# EAGLE design Shifter SMD v16 (EAGLE 6.4)
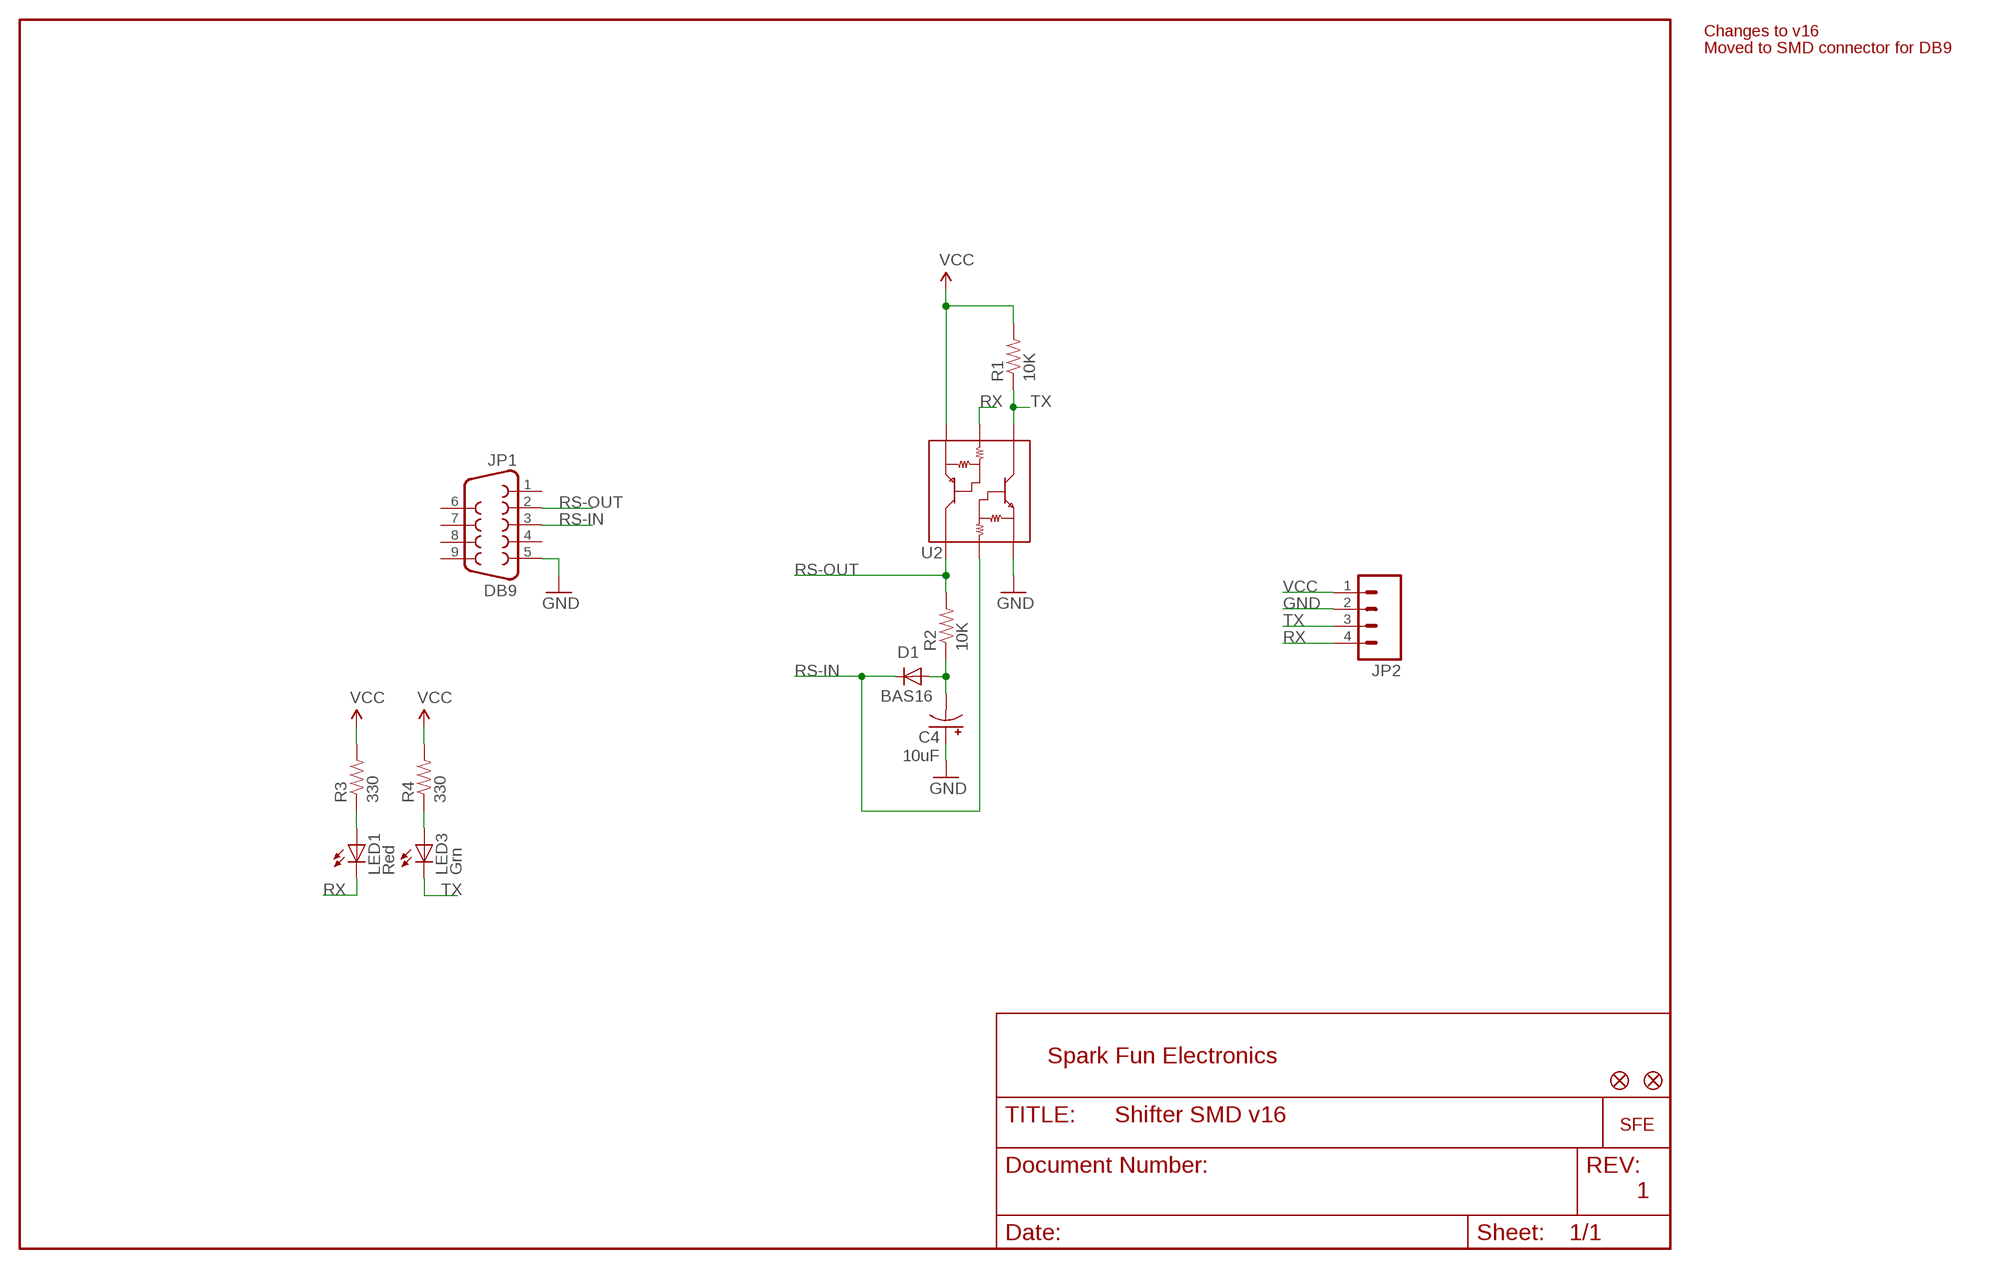
[diagram p0: schematic, sheet 1]

## Parts
C4  10uF  CAP_POL1206  [EIA3216]
D1  BAS16  DIODESOD  [SOD-323]
E$1  FIDUCIAL1X2  [FIDUCIAL-1X2]
E$2  FIDUCIAL1X2  [FIDUCIAL-1X2]
JP1  DB9  DB9L17SM209S114T  [DB9-L17SM209S114T]
JP2  M04PTH  [1X04]
LED1  Red  LED1206  [LED-1206]
LED3  Grn  LED1206  [LED-1206]
R1  10K  RESISTOR0603-RES  [0603-RES]
R2  10K  RESISTOR0603-RES  [0603-RES]
R3  330  RESISTOR0603-RES  [0603-RES]
R4  330  RESISTOR0603-RES  [0603-RES]
U2  XN04312  XN04312SOT  [SOT23-6]
U$1  LOGO-SFENEW  [SFE-NEW-WEBLOGO]

## Nets
GND: C4.A(+) JP1.5 JP2.2 U2.6(E1)
N$1: LED1.A R3.1
N$2: LED3.A R4.1
N$4: C4.C(-) D1.2(A) R2.1
RS-IN: D1.1(C) JP1.3 U2.5(B1)
RS-OUT: JP1.2 R2.2 U2.4(C2)
RX: JP2.4 LED1.C U2.2(B2)
TX: JP2.3 LED3.C R1.1 U2.1(C1)
VCC: JP2.1 R1.2 R3.2 R4.2 U2.3(E2)
Unconnected: JP1.1 JP1.4 JP1.6 JP1.7 JP1.8 JP1.9

## Notes on the sheet
- Changes to v16
- Moved to SMD connector for DB9
- Spark Fun Electronics
- 1

## Library data of the parts
C4 = SparkFun:CAP_POL: Capacitor Polarized These are standard SMD and PTH capacitors. Normally 10uF, 47uF, and 100uF in electrolytic and tantalum varieties. Always verify the external diameter of the through hole cap, it varies with capacity, voltage, and manufacturer. The EIA devices should be standard.
D1 = SparkFun:DIODE: Diode These are standard reverse protection diodes and small signal diodes. SMA package can handle up to about 1A. SOD-323 can handle about 200mA. What the SOD-323 package when ordering, there are some mfgs out there that are 5-pin packages.
E$1 E$2 = SparkFun:FIDUCIAL: Fiducial Alignment Points Various fiducial points for machine vision alignment.
JP1 = Testing:DB9: DB9 Connector Standard DB9 (D-Sub 9) serial connector. Can be used for CAN bus as well as RS485 and RS232. Footprint production proven. Spark Fun Electronics SKU : PRT-00429
JP2 = SparkFun:M04: Header 4 Standard 4-pin 0.1" header. Use with straight break away headers (SKU : PRT-00116), right angle break away headers (PRT-00553), swiss pins (PRT-00743), machine pins (PRT-00117), and female headers (PRT-00115). Molex polarized connector foot print use with SKU : PRT-08231 with associated crimp pins and housings.
LED1 LED3 = SparkFun:LED: LEDs Standard schematic elements and footprints for 5mm, 3mm, 1206, and 0603 sized LEDs. 5mm - Spark Fun Electronics SKU : COM-00529 (and others)
R1-R4 = SparkFun:RESISTOR: Resistor Basic schematic elements and footprints for 0603, 1206, and PTH resistors.
U2 = SparkFun:XN04312: NPN/PNP Transistor Array Handy dandy transistor array for level shifting and inverting signals. Spark Fun Electronics SKU : COM-00588
U$1 = SparkFun:LOGO-SFE: Spark Fun Electronics PCB Logo This is the standard Spark Fun Electronics PCB logo.

## Net classes
0 default: width 0.203 mm
1 power: width 0.203 mm

## Board
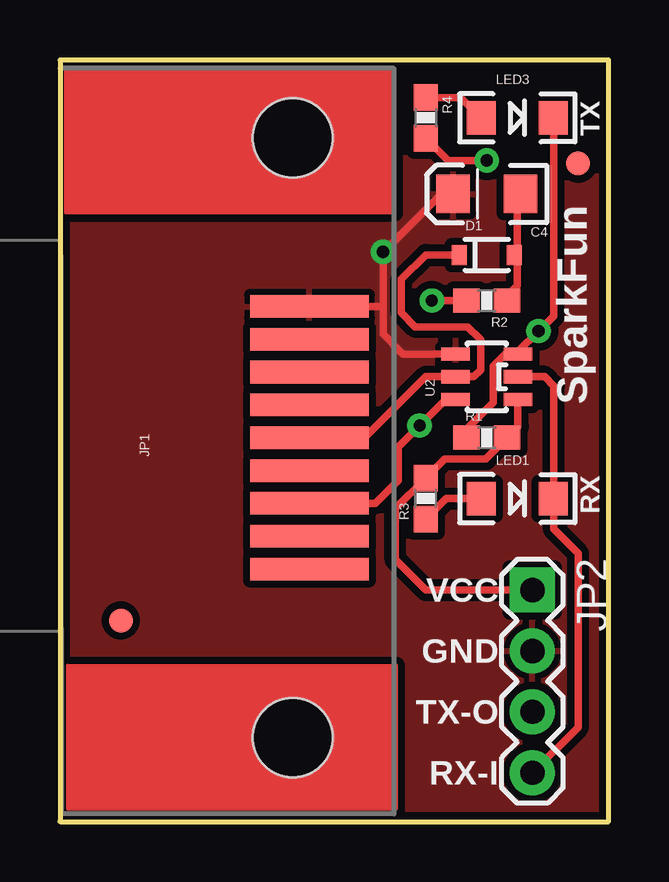
[diagram p1: board, top side]
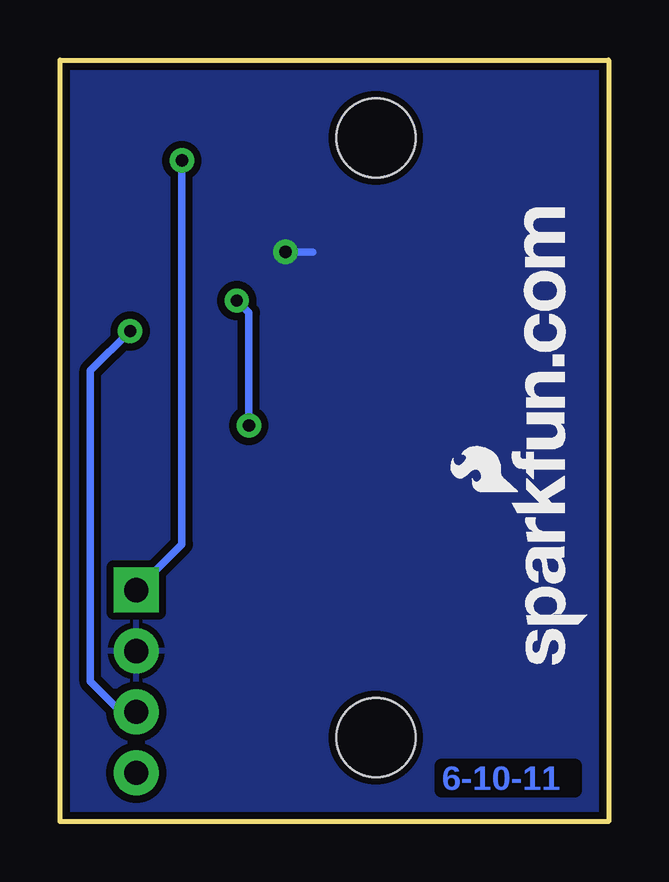
[diagram p2: board, bottom side, seen from below]

Size 22.86 x 31.75 mm. Coordinates in mm from the lower left corner, seen from the top.
Outline: 0,0 22.86,0 22.86,31.75 0,31.75 0,0
Copper layers (1*16): Top 0.035mm / dielectric 1.5mm / Bottom 0.035mm
Design rules "SparkFun": minimum track width 8mil, minimum drill 20mil, track to track 8mil, track to pad 8mil, pad to pad 8mil, via to via 8mil, smd to smd 8mil, copper to edge 10mil, drill to drill 8mil, minimum pad ring 12mil, minimum via ring 10mil, stop-mask expansion 4mil, vias tented up to drill 20mil, thermal gap 10mil

### Footprints (pad centres in the part's own frame; a part is rotated, then mirrored left to right if it is on the bottom)
EIA3216 = smd 1.4 x 1.6: A 1.4,0; C -1.4,0
SOD-323 = smd 0.63 x 0.83: 1 -1.15,0; 2 1.15,0
FIDUCIAL-1X2 = smd 1 x 1: 1 0,0
DB9-L17SM209S114T = smd 0.94 x 4.953: 1 -5.476,-4.043; 2 -2.738,-4.043; 3 0,-4.043; 4 2.738,-4.043; 5 5.476,-4.043; 6 -4.107,-4.043; 7 -1.369,-4.043; 8 1.369,-4.043; 9 4.107,-4.043 | hole 3.3: -12.5,-3.35; 12.5,-3.35
1X04 = drill 1.016 pad 1.88 square: 1 0,0 | drill 1.016 pad 1.88: 2 2.54,0; 3 5.08,0; 4 7.62,0
LED-1206 = smd 1.2 x 1.4: A -1.5,0; C 1.5,0
0603-RES = smd 1.1 x 1: 1 -0.85,0; 2 0.85,0
SOT23-6 = smd 0.55 x 1.2: 1 0.95,-1.3; 2 0,-1.3; 3 -0.95,-1.3; 4 -0.95,1.3; 5 0,1.3; 6 0.95,1.3

### Placement (x,y rotation side)
C4  17.78,26.16 180 top
D1  17.78,23.62 0 top
E$1  2.54,8.38 0 top
E$2  21.59,27.43 0 top
JP1  6.35,16 90 top
JP2  19.68,9.65 270 top
LED1  19.05,13.46 0 top
LED3  19.05,29.34 0 top
R1  17.78,16 0 top
R2  17.78,21.72 180 top
R3  15.24,13.46 90 top
R4  15.24,29.34 270 top
U2  17.78,18.54 90 top
U$1  0.9,6.55 90 bottom

### Tracks (layer width: path | path; a pad name or v marks a point on that pad's centre or on a via)
GND  (via drill 0.51)
  Top 0.305: 16.51,26.16 C4.A 15.88,26.16 v13.46,23.75 13.46,21.48 | U2.6 14.29,19.49 13.46,20.32 13.46,21.48 | JP1.5 13.46,21.48
  Bottom 0.305: v13.46,23.75 12.32,23.75
  pour Bottom (isolate 0.305): 0,31.75 22.86,31.75 22.86,0 0,0
  pour Top (isolate 0.305): 0,0 0,31.75 22.86,31.75 22.86,0
N$1
  Top 0.305: 17.78,13.46 LED1.A 16.09,13.46 R3.1
N$2
  Top 0.305: 17.53,29.34 LED3.A 16.7,30.19 R4.1
N$4
  Top 0.305: C4.C 19.05,26.16 19.05,23.74 D1.2 19.05,23.62 19.05,22.35 18.43,21.73 R2.1
RS-IN
  Top 0.305: U2.5 16.51,18.54 | U2.5 15.24,18.54 12.7,16 JP1.3 | U2.5 17.25,18.54 17.53,18.82 17.53,20.09 16.99,20.62 14.81,20.62 14.22,21.21 14.22,22.61 15.24,23.62 D1.1
RS-OUT  (via drill 0.51)
  Top 0.305: 16.48,17.5 U2.4 16.07,17.59 v14.99,16.51 14.1,15.62 14.1,14.22 13.14,13.26 JP1.2 | 17.13,21.61 R2.2 v15.49,21.72
  Bottom 0.305: v14.99,16.51 14.99,21.21 v15.49,21.72
RX
  Top 0.305: LED1.C 20.32,13.46 | JP2.4 21.59,3.94 21.59,11.18 20.57,12.19 20.57,13.46 LED1.C | U2.2 20.19,18.54 20.57,18.16 20.57,13.59 20.55,13.56 LED1.C
TX  (via drill 0.51)
  Top 0.305: LED3.C 20.55,29.23 20.57,29.21 20.57,21.08 v19.94,20.45 19.08,19.59 U2.1 19.12,19.49 | 19.12,19.49 19.13,19.48 | 19.12,19.49 19.1,19.51 18.57,19.51 18.06,19 18.06,17.48 16.93,16.35 R1.1
  Bottom 0.305: JP2.3 20.32,4.57 21.59,5.84 21.59,18.8 v19.94,20.45
VCC  (via drill 0.51)
  Top 0.305: R4.2 15.24,28.7 | R4.2 15.24,28.32 | U2.3 19.08,16.45 R1.2 17.74,15.11 16.04,15.11 R3.2 13.97,13.04 13.97,10.92 15.24,9.65 JP2.1 | v17.78,27.56 16.17,27.56 R4.2
  Bottom 0.305: JP2.1 17.78,11.56 v17.78,27.56

### Text on the board
Bottom: 6-10-11
tPlace: TX | SparkFun | RX | VCC | GND | TX-O | RX-I